# Altium schematic sheet Sheet1.SchDoc
size A4
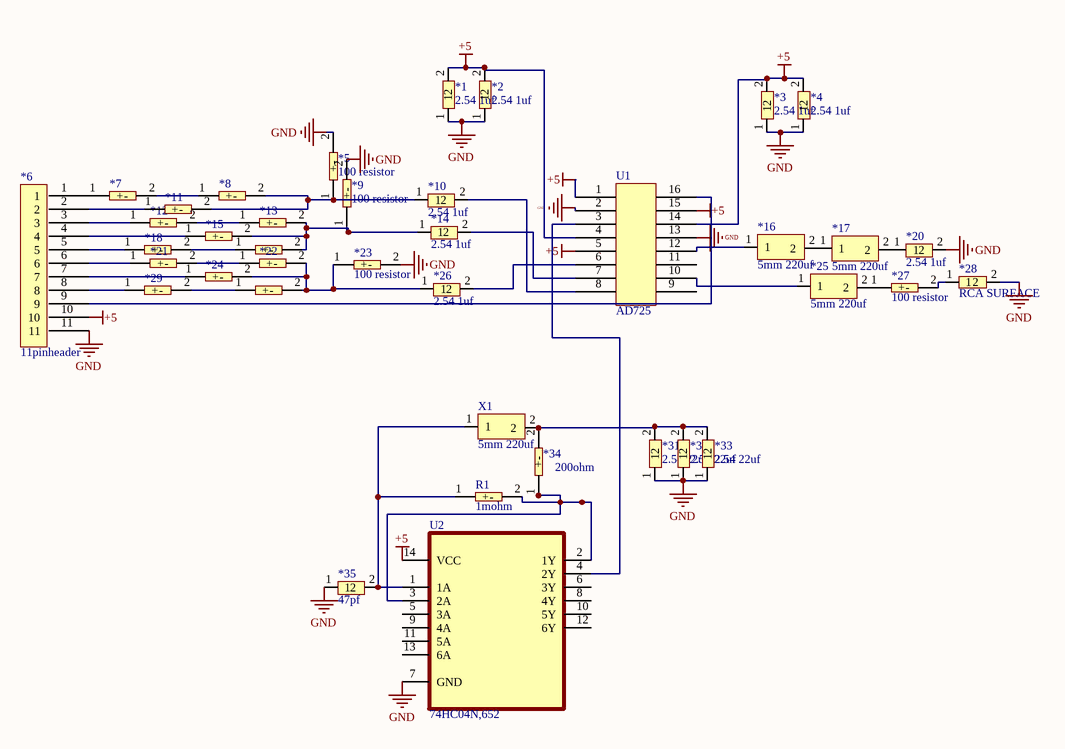
[diagram p0: Sheet1.SchDoc]

## Parts
*1  2.54 1uf  [2.54mm 1uf]
*2  2.54 1uf  [2.54mm 1uf]
*3  2.54 1uf  [2.54mm 1uf]
*4  2.54 1uf  [2.54mm 1uf]
*5  100 resistor  [100 resistor]
*6  11pinheader  [11xpinheader]
*7  100 resistor  [100 resistor]  (value not drawn)
*8  100 resistor  [100 resistor]  (value not drawn)
*9  100 resistor  [100 resistor]
*10  2.54 1uf  [2.54mm 1uf]
*11  100 resistor  [100 resistor]  (value not drawn)
*12  100 resistor  [100 resistor]  (value not drawn)
*13  100 resistor  [100 resistor]  (value not drawn)
*14  2.54 1uf  [2.54mm 1uf]
*15  100 resistor  [100 resistor]  (value not drawn)
*16  5mm 220uf  [5mm 220uF]
*17  5mm 220uf  [5mm 220uF]
*18  100 resistor  [100 resistor]  (value not drawn)
*19  100 resistor  [100 resistor]  (value not drawn)
*20  2.54 1uf  [2.54mm 1uf]
*21  100 resistor  [100 resistor]  (value not drawn)
*22  100 resistor  [100 resistor]  (value not drawn)
*23  100 resistor  [100 resistor]
*24  100 resistor  [100 resistor]  (value not drawn)
*25  5mm 220uf  [5mm 220uF]
*26  2.54 1uf  [2.54mm 1uf]
*27  100 resistor  [100 resistor]
*28  RCA SURFACE  [RCA SURFACE]
*29  100 resistor  [100 resistor]  (value not drawn)
*30  100 resistor  [100 resistor]  (value not drawn)
*31  2.54 22uf  [2.54mm 1uf]
*32  2.54 22uf  [2.54mm 1uf]
*33  2.54 22uf  [2.54mm 1uf]
*34  200ohm  [100 resistor]
*35  47pf  [2.54mm 1uf]
R1  1mohm  [100 resistor]
U1  AD725  [AD725 SOIC16]
U2  74HC04N,652  [DIP254P762X420-14]
X1  5mm 220uf  [5mm 220uF]

## Nets
+5: *1.2 *2.2 *3.2 *4.2 *6.10 U1.1 U1.4 U1.5 U1.14 U1.15 U2.14(VCC)
GND: *1.1 *2.1 *3.1 *4.1 *5.2(-) *6.11 *9.2(-) *20.2 *23.2(-) *28.2 *31.1 *32.1 *33.1 *35.1 U1.2 U1.13 U2.7(GND)
Net*5_1: *5.1(+) *8.2(-) *10.1 *11.2(-)
Net*6_1: *6.1 *7.1(+)
Net*6_2: *6.2 *11.1(+)
Net*6_3: *6.3 *12.1(+)
Net*6_4: *6.4 *15.1(+)
Net*6_5: *6.5 *18.1(+)
Net*6_6: *6.6 *21.1(+)
Net*6_7: *6.7 *24.1(+)
Net*6_8: *6.8 *29.1(+)
Net*6_9: *6.9 U1.16
Net*7_2: *7.2(-) *8.1(+)
Net*9_1: *9.1(+) *13.2(-) *14.1 *15.2(-) *19.2(-)
Net*10_2: *10.2 U1.8
Net*12_2: *12.2(-) *13.1(+)
Net*14_2: *14.2 U1.7
Net*16_1: *16.1 U1.12
Net*16_2: *16.2 *17.1
Net*17_2: *17.2 *20.1
Net*18_2: *18.2(-) *19.1(+)
Net*21_2: *21.2(-) *22.1(+)
Net*22_2: *22.2(-) *23.1(+) *24.2(-) *26.1 *30.2(-)
Net*25_1: *25.1 U1.10
Net*25_2: *25.2 *27.1(+)
Net*26_2: *26.2 U1.6
Net*27_2: *27.2(-) *28.1
Net*29_2: *29.2(-) *30.1(+)
Net*31_2: *31.2 *32.2 *33.2 *34.2(-) X1.2
Net*34_1: *34.1(+) R1.2(-) U2.2(1Y) U2.3(2A)
Net*35_2: *35.2 R1.1(+) U2.1(1A) X1.1
NetU1_3: U1.3 U2.4(2Y)

Not connected (* = marked no-connect by the designer): U1 9 11; U2 5(3A) 6(3Y) 8(4Y) 9(4A) 10(5Y) 11(5A) 12(6Y) 13(6A)

## Library data of the parts
*31-*33 *35 = 2.54 1uf
*34 R1 = 100 resistor
U2 = 74HC04N,652: Inverter IC 6 Channel 14-DIP; MF: NXP USA; Value: *; MP: 74HC04N,652; Availability: Unavailable; SnapEDA_Link: https://www.snapeda.com/parts/74HC04N,652/NXP%20USA%20Inc./view-part/643968/?ref=snap; Price: None; Package: DIP-14 Nexperia